# Altium schematic sheet bqZUM_Bluetooth.SchDoc: Bluetooth
size A3; Author: Raúl de Pablos; CompanyName: bq - Mundo Reader; Organization: bq - Mundo Reader; DocumentNumber: 3; Revision: 2.6; SheetNumber: 3; SheetTotal: 8; ProjectName: ZUM BT328
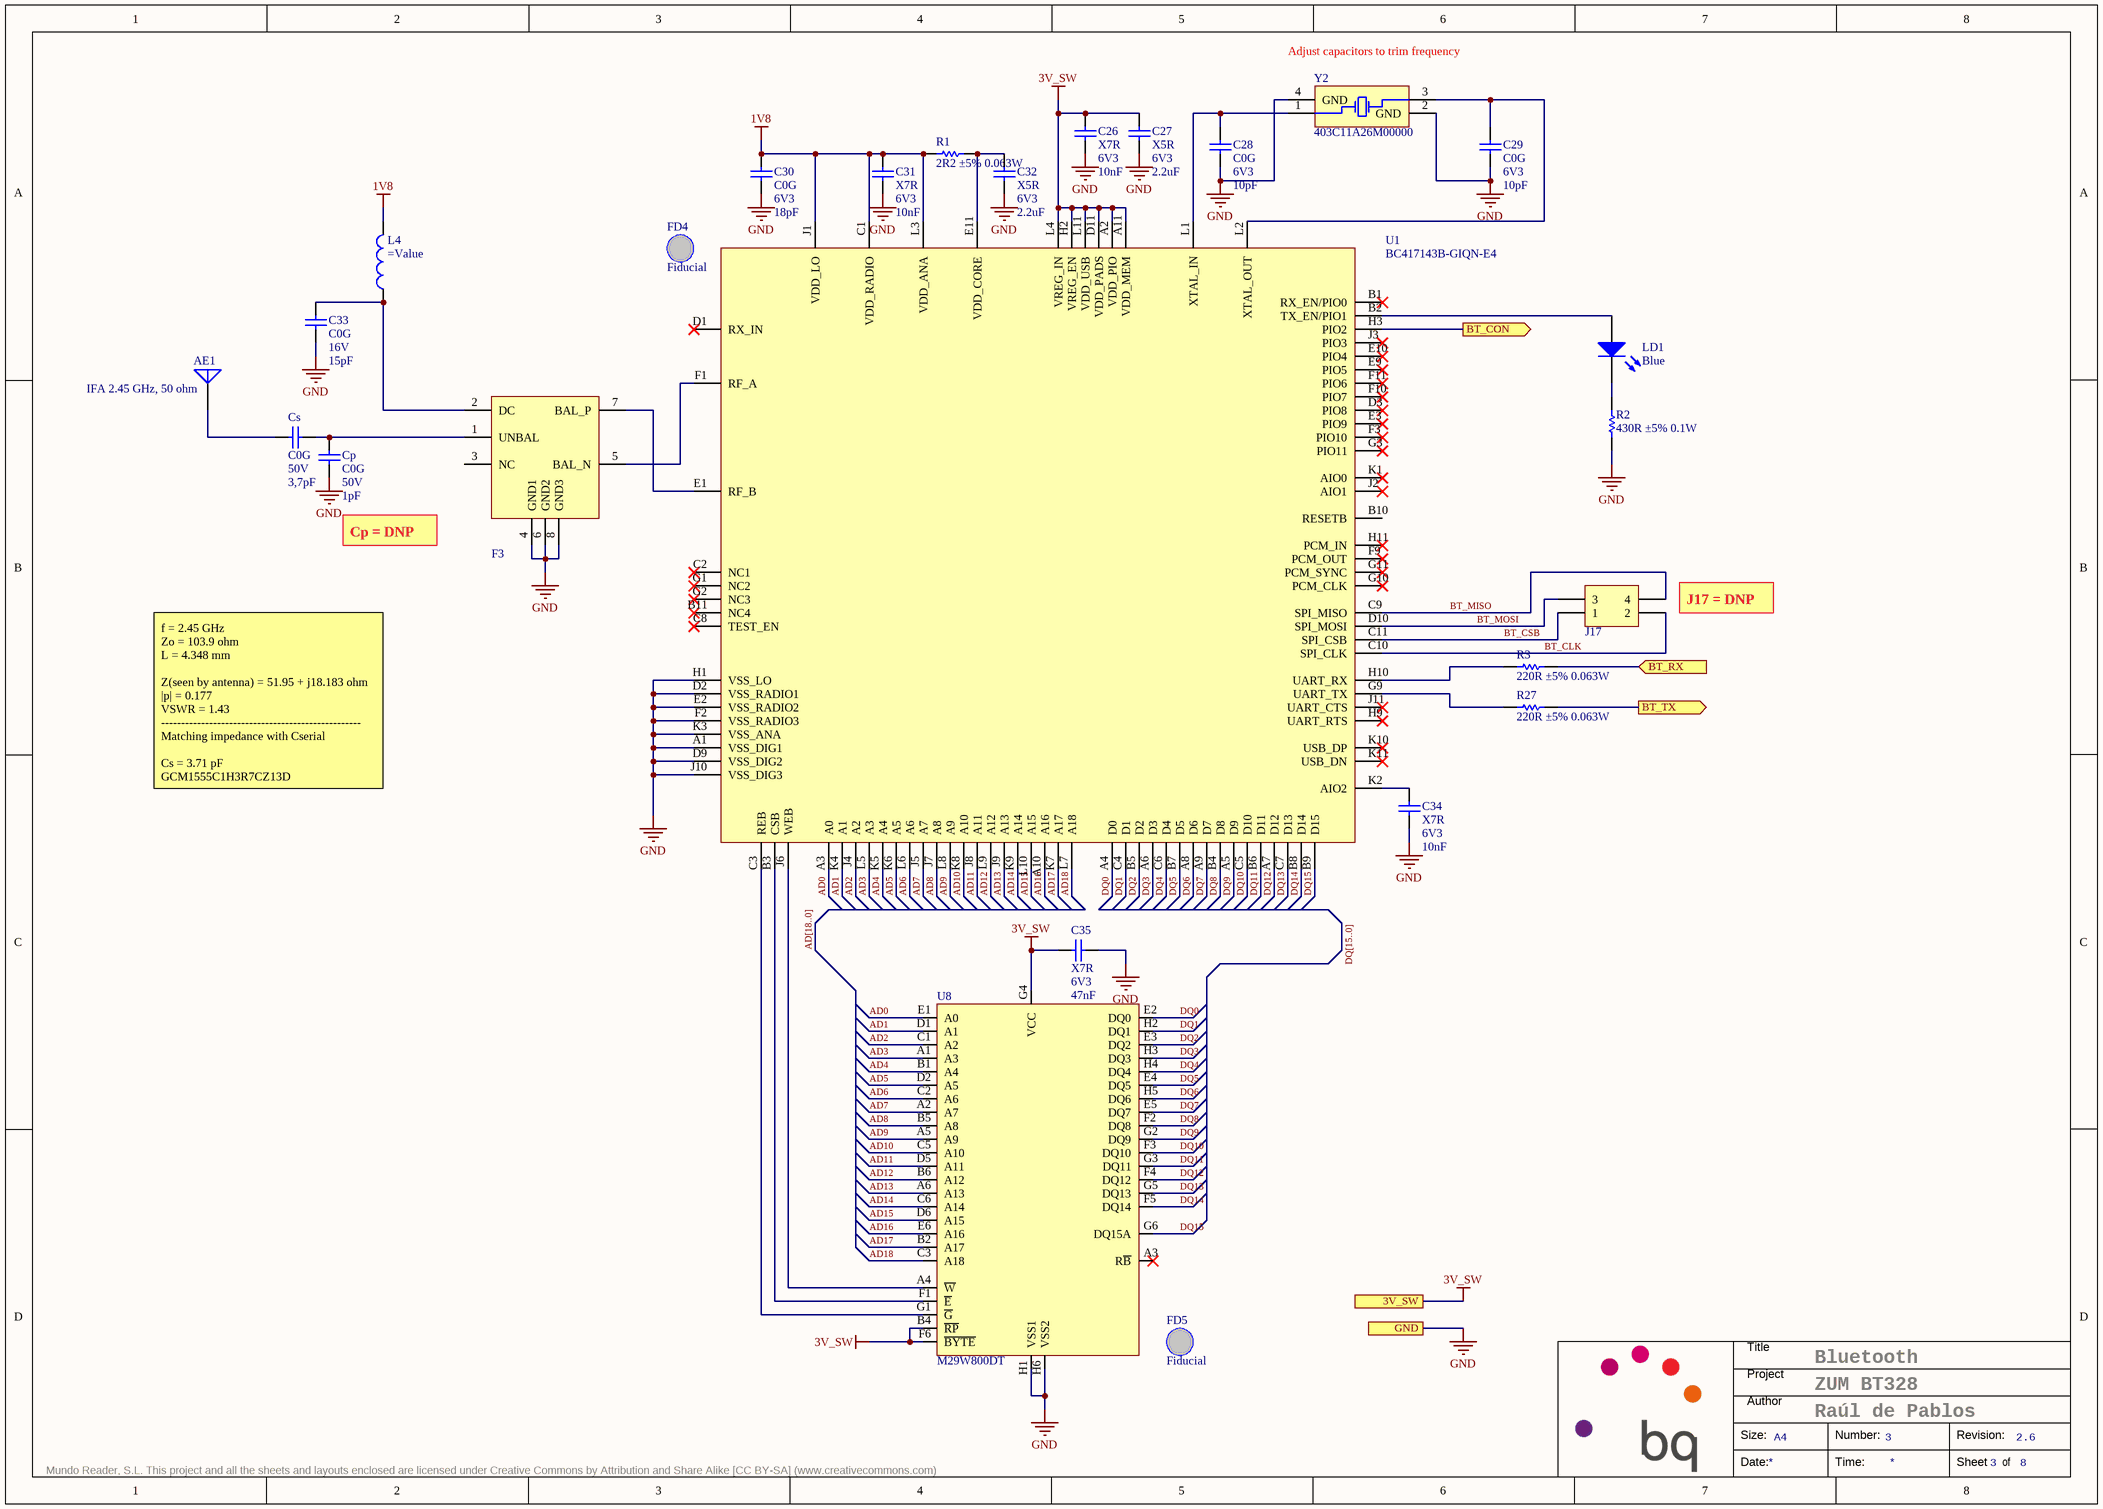
[diagram p0: bqZUM_Bluetooth.SchDoc]

## Parts
AE1  (no value)  [IFA_2,45GHZ_50OHM]  (no BOM)
C26  Dielectric: X7R  Voltage: 6V3  Capacitance: 10nF  [C0402]  (hidden comment: Capacitor)
C27  Dielectric: X5R  Voltage: 6V3  Capacitance: 2.2uF  [C0603]  (hidden comment: Capacitor)
C28  Dielectric: C0G  Voltage: 6V3  Capacitance: 10pF  [C0402]  (hidden comment: Capacitor)
C29  Dielectric: C0G  Voltage: 6V3  Capacitance: 10pF  [C0402]  (hidden comment: Capacitor)
C30  Dielectric: C0G  Voltage: 6V3  Capacitance: 18pF  [C0402]  (hidden comment: Capacitor)
C31  Dielectric: X7R  Voltage: 6V3  Capacitance: 10nF  [C0402]  (hidden comment: Capacitor)
C32  Dielectric: X5R  Voltage: 6V3  Capacitance: 2.2uF  [C0603]  (hidden comment: Capacitor)
C33  Dielectric: C0G  Voltage: 16V  Capacitance: 15pF  [C0402]  (hidden comment: Capacitor)
C34  Dielectric: X7R  Voltage: 6V3  Capacitance: 10nF  [C0402]  (hidden comment: Capacitor)
C35  Dielectric: X7R  Voltage: 6V3  Capacitance: 47nF  [C0402]  (hidden comment: Capacitor)
Cp  Dielectric: C0G  Voltage: 50V  Capacitance: 1pF  [C0402]  (hidden comment: Capacitor)  (no BOM)
Cs  Dielectric: C0G  Voltage: 50V  Capacitance: 3,7pF  [C0402]  (hidden comment: Capacitor)
F3  BP_Filter_Balun  [2450FB15K0005]  (value not drawn)
FD4  Fiducial  [Fiducial_Local_0.4mm]  (no BOM)
FD5  Fiducial  [Fiducial_Local_0.4mm]  (no BOM)
J17  2x2 Header 1.27mm  [2x2 Header THT 1.27mm]  (value not drawn)  (no BOM)
L4  (no value)  [L0402]
LD1  Blue  [LED0603]
R1  value 2R2 ±5% 0.063W  [R0402]  (hidden comment: Resistor)
R2  value 430R ±5% 0.1W  [R0603]  (hidden comment: Resistor)
R3  value 220R ±5% 0.063W  [R0402]  (hidden comment: Resistor)
R27  value 220R ±5% 0.063W  [R0402]  (hidden comment: Resistor)
U1  BC417143B-GIQN-E4  [TFBGA96P8X8]
U8  S29AL008J70BFI02  [TFBGA48P6X8]  (value not drawn)
Y2  403C11A26M00000  [XTAL 3.2x2.5]

## Ports
3V_SW, BT_CON (out), BT_RX (in), BT_TX (out), GND

## Nets
1V8: C30.2 C31.2 L4.2 R1.2 U1.C1(VDD_RADIO) U1.J1(VDD_LO) U1.L3(VDD_ANA)
3V_SW: C26.2 C27.2 C35.1 U1.A2(VDD_PIO) U1.A11(VDD_MEM) U1.D11(VDD_PADS) U1.H2(VREG_EN) U1.L4(VREG_IN) U1.L11(VDD_USB) U8.B4(~{RP}) U8.F6(~{BYTE}) U8.G4(VCC) ; port 3V_SW
GND: C26.1 C27.1 C28.1 C29.1 C30.1 C31.1 C32.1 C33.1 C34.1 C35.2 Cp.1 F3.4(GND1) F3.6(GND2) F3.8(GND3) R2.1 U1.A1(VSS_DIG1) U1.D2(VSS_RADIO1) U1.D9(VSS_DIG2) U1.E2(VSS_RADIO2) U1.F2(VSS_RADIO3) U1.H1(VSS_LO) U1.J10(VSS_DIG3) U1.K3(VSS_ANA) U8.H1(VSS1) U8.H6(VSS2) Y2.2(GND) Y2.4(GND) ; port GND
AD0: U1.A3(A0) U8.E1(A0)
AD1: U1.K4(A1) U8.D1(A1)
AD2: U1.J4(A2) U8.C1(A2)
AD3: U1.L5(A3) U8.A1(A3)
AD4: U1.K5(A4) U8.B1(A4)
AD5: U1.K6(A5) U8.D2(A5)
AD6: U1.L6(A6) U8.C2(A6)
AD7: U1.J5(A7) U8.A2(A7)
AD8: U1.J7(A8) U8.B5(A8)
AD9: U1.L8(A9) U8.A5(A9)
AD10: U1.K8(A10) U8.C5(A10)
AD11: U1.J8(A11) U8.D5(A11)
AD12: U1.L9(A12) U8.B6(A12)
AD13: U1.J9(A13) U8.A6(A13)
AD14: U1.K9(A14) U8.C6(A14)
AD15: U1.L10(A15) U8.D6(A15)
AD16: U1.A10(A16) U8.E6(A16)
AD17: U1.K7(A17) U8.B2(A17)
AD18: U1.L7(A18) U8.C3(A18)
BT_CLK: J17.2 U1.C10(SPI_CLK)
BT_CON: U1.H3(PIO2) ; port BT_CON
BT_CSB: J17.1 U1.C11(SPI_CSB)
BT_MISO: J17.4 U1.C9(SPI_MISO)
BT_MOSI: J17.3 U1.D10(SPI_MOSI)
BT_RX: R3.2 ; port BT_RX
BT_TX: R27.2 ; port BT_TX
DQ0: U1.A4(D0) U8.E2(DQ0)
DQ1: U1.C4(D1) U8.H2(DQ1)
DQ2: U1.B5(D2) U8.E3(DQ2)
DQ3: U1.A6(D3) U8.H3(DQ3)
DQ4: U1.C6(D4) U8.H4(DQ4)
DQ5: U1.B7(D5) U8.E4(DQ5)
DQ6: U1.A8(D6) U8.H5(DQ6)
DQ7: U1.A9(D7) U8.E5(DQ7)
DQ8: U1.B4(D8) U8.F2(DQ8)
DQ9: U1.A5(D9) U8.G2(DQ9)
DQ10: U1.C5(D10) U8.F3(DQ10)
DQ11: U1.B6(D11) U8.G3(DQ11)
DQ12: U1.A7(D12) U8.F4(DQ12)
DQ13: U1.C7(D13) U8.G5(DQ13)
DQ14: U1.B8(D14) U8.F5(DQ14)
DQ15: U1.B9(D15) U8.G6(DQ15A)
NetAE1_FEED: AE1.FEED Cs.1
NetC28_2: C28.2 U1.L1(XTAL_IN) Y2.1(OSC1)
NetC29_2: C29.2 U1.L2(XTAL_OUT) Y2.3(OSC2)
NetC32_2: C32.2 R1.1 U1.E11(VDD_CORE)
NetC33_2: C33.2 F3.2(DC) L4.1
NetC34_2: C34.2 U1.K2(AIO2)
NetCp_2: Cp.2 Cs.2 F3.1(UNBAL)
NetF3_5: F3.5(BAL_N) U1.F1(RF_A)
NetF3_7: F3.7(BAL_P) U1.E1(RF_B)
NetLD1_A: LD1.A U1.B2(TX_EN/PIO1)
NetLD1_K: LD1.K R2.2
NetR3_1: R3.1 U1.H10(UART_RX)
NetR27_1: R27.1 U1.G9(UART_TX)
NetU1_B3: U1.B3(CSB) U8.F1(~{E})
NetU1_C3: U1.C3(REB) U8.G1(~{G})
NetU1_J6: U1.J6(WEB) U8.A4(~{W})

Not connected (* = marked no-connect by the designer): AE1 GND; F3 3(NC); U1 B1(RX_EN/PIO0)* B10(RESETB) B11(NC4)* C2(NC1)* C8(TEST_EN)* D1(RX_IN)* D3(PIO8)* E3(PIO9)* E9(PIO5)* E10(PIO4)* F3(PIO10)* F9(PCM_OUT)* F10(PIO7)* F11(PIO6)* G1(NC2)* G2(NC3)* G3(PIO11)* G10(PCM_CLK)* G11(PCM_SYNC)* H9(UART_RTS)* H11(PCM_IN)* J2(AIO1)* J3(PIO3)* J11(UART_CTS)* K1(AIO0)* K10(USB_DP)* K11(USB_DN)*; U8 A3(R~{B})*

## Buses and harness runs
bus AD[18..0]
bus DQ[15..0]

## Notes on the sheet
- (near Y2) Adjust capacitors to trim frequency
- (near AE1) IFA 2.45 GHz, 50 ohm
- Cp = DNP
- (near J17) J17 = DNP
- f = 2.45 GHz
  Zo = 103.9 ohm
  L = 4.348 mm
  Z(seen by antenna) = 51.95 + j18.183 ohm
  |p| = 0.177
  VSWR = 1.43
  --------------------------------------------------
  Matching impedance with Cserial
  Cs = 3.71 pF
  GCM1555C1H3R7CZ13D
- Title
- Project
- Size:
- Author
- A4
- Number:
- Revision:
- Mundo Reader, S.L. This project and all the sheets and layouts enclosed are licensed under Creative Commons by Attribution and Share Alike [CC BY-SA] (www.creativecommons.com)
- Date:
- Time:
- Sheet
- of

## Library data of the parts
AE1 = Microstrip_2.4GHz: Antenna with Ground; Value: 2,4GHz; Part Number: Microstrip_2.4GHz
C26 C31 C34 = C0402_10nF_6V3_±10%: Manufacturer: Kemet; Value: 10nF ±10% 6V3; Tolerance: ±10%; OrderingCode: C0402C103K9RAC; Temp_ Max: 125; Temp_ Min: -55; Part Number: C0402_10nF_6V3_±10%
C27 C32 = C0603_2.2uF_6V3_±10%: Manufacturer: Kemet; Value: 2.2uF ±10% 6V3; Tolerance: ±10%; OrderingCode: C0603C225K9PAC; Temp_ Max: 125; Temp_ Min: -55; Part Number: C0603_2.2uF_6V3_±10%
C28 C29 = C0402_10pF_6V3_±10%: Manufacturer: Kemet; Value: 10pF ±10% 6V3; Tolerance: ±10%; OrderingCode: C0402C100K9GAC; Temp_ Max: 125; Temp_ Min: -55; Part Number: C0402_10pF_6V3_±10%
C30 = C0402_18pF_6V3_±10%: Manufacturer: Kemet; Value: 18pF ±10% 6V3; Tolerance: ±10%; OrderingCode: C0402C180K9GAC; Temp_ Max: 125; Temp_ Min: -55; Part Number: C0402_18pF_6V3_±10%
C33 = C0402_15pF_16V_±10%: Manufacturer: Kemet; Value: 15pF ±10% 16V; Tolerance: ±10%; OrderingCode: C0402C150K4GAC; Temp_ Max: 125; Temp_ Min: -55; Part Number: C0402_15pF_16V_±10%
C35 = C0402_47nF_6V3_±10%: Manufacturer: Kemet; Value: 47nF ±10% 6V3; Tolerance: ±10%; OrderingCode: C0402C473K9RAC; Temp_ Max: 125; Temp_ Min: -55; Part Number: C0402_47nF_6V3_±10%
Cp = C0402_1pF_50V_0.25pF: Manufacturer: Murata; Value: 1pF 0.25pF 50V; Tolerance: 0.25pF; OrderingCode: GRM1555C1H1R0CZ01D; Temp_ Max: 125; Temp_ Min: -55; Part Number: C0402_1pF_50V_0.25pF
Cs = C0402_3,7pF_50V_±7%: Manufacturer: Murata; Value: 3,7pF ±7% 50V; Tolerance: ±7%; OrderingCode: GCM1555C1H3R7CZ13D; Temp_ Max: 125; Temp_ Min: -55; Part Number: C0402_3,7pF_50V_±7%
F3 = BP_Filter_Balun: Band Pass Balun Filter; Manufacturer: Johanson Technlogy; OrderingCode: 2450FB15K0005E; Temp_ Max: 85; Temp_ Min: -40; OrderingCode 2: DBF81F104-CSR-T; Part Number: BP_Filter_Balun; Manufacturer 2: Soshin
FD4 FD5 = Fiducial Local 0.4mm: Part Number: Fiducial Local 0.4mm
J17 = CON_DPH_THT_1.27_4: 4 pin Dual Header 1.27mm; Manufacturer: Würth; OrderingCode: 622 004 211 21; Temp_ Max: 125; Temp_ Min: -40; Pitch: 1.27mm; Part Number: CON_DPH_THT_1.27_4
L4 = 15nH_0,3A: Inductor SMD; Manufacturer: Murata; L: 15nH; Rdc: 0,320R; Current: 0,3A; Current Sat#: 5,72A; OrderingCode: LQG15HS15NJ02D; Temp_ Max: 125; Temp_ Min: -55; Value: 15nH 0,3A; Part Number: 15nH_0,3A
LD1 = LTST-C194TBKT: Light Emitting Diode; Manufacturer: Lite-On; Temp_ Max: 80; Temp_ Min: -20; OrderingCode 2: HSMN-C120; Part Number: LTST-C194TBKT; OrderingCode: LTST-C194TBKT; Manufacturer 2: Avago Technologies; Value: Blue
R1 = R0402_2R2_0.063W_±5%: Manufacturer: Vishay; Tolerance: ±5%; OrderingCode: CRCW04022R20JN; Power: 0.063W; Resistance: 2R2; Temp_ Max: 155; Temp_ Min: -55; PackageDescription: SMD; Part Number: R0402_2R2_0.063W_±5%
R2 = R0603_430R_0.1W_±5%: Manufacturer: Vishay; Tolerance: ±5%; OrderingCode: CRCW0603430RJN; Power: 0.1W; Resistance: 430R; Temp_ Max: 155; Temp_ Min: -55; PackageDescription: SMD; Part Number: R0603_430R_0.1W_±5%
R3 R27 = R0402_220R_0.063W_±5%: Manufacturer: Vishay; Tolerance: ±5%; OrderingCode: CRCW0402220RJN; Power: 0.063W; Resistance: 220R; Temp_ Max: 155; Temp_ Min: -55; PackageDescription: SMD; Part Number: R0402_220R_0.063W_±5%
U1 = BlueCore4-EXT: Bluetooth Modem, 2.4-GHz Bluetooth SoC; Manufacturer: CSR; Temp_ Max: 105; Temp_ Min: -40; Part Number: BlueCore4-EXT; OrderingCode: BC417143B-GIQN-E4
U8 = M29W800DT: Memory NOR Flash 8-Mbit 3 V supply; Manufacturer: Spansion; Temp_ Max: 125; Temp_ Min: -50; OrderingCode 2: M29W800DB70ZE6E; OrderingCode 3: MX29LV800CBXEI-70G; Value: 8MB; Part Number: M29W800DT; OrderingCode: S29AL008J70BFI02; Manufacturer 2: Micron; Manufacturer 3: Macronix
Y2 = 403C11A 26MHz: Crystal; Manufacturer: CTS; Tolerance: ±10ppm; Load Capacitance: 10pF; Temp_ Max: 70; Temp_ Min: -20; OrderingCode 2: ABM8-26.000MHZ-10-1-U-T; Value: 26MHz; Part Number: 403C11A 26MHz; OrderingCode: 403C11A26M00000; Manufacturer 2: Abracon